# Altium project Battery_Charger_BQ24650.PrjPcb (part 2 of 3)
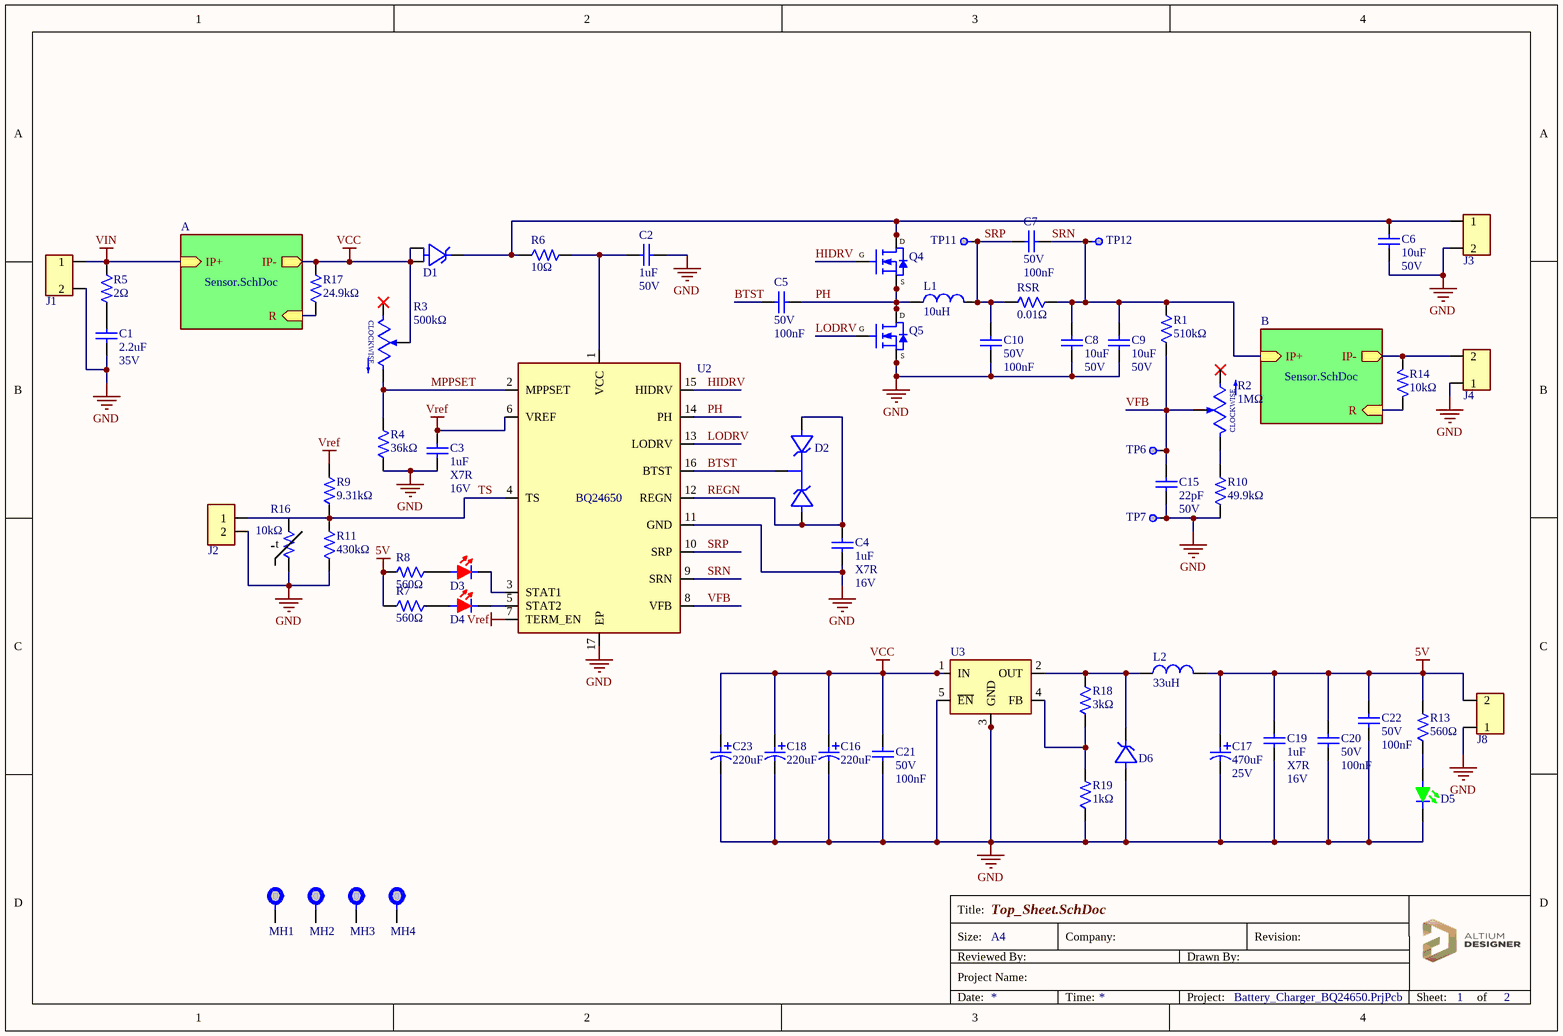
[diagram p2: Top_Sheet.SchDoc]

## Sheet Top_Sheet.SchDoc (continued)

### Library data of the parts
? = Title Block
C1 = Cap 2.2uF 35V X7R 1210(3225) 10% MLCC_GMK316B7225KLHT: Cap Ceramic 2.2uF 35V X7R 10% Pad SMD 1206 125C Automotive T/R; Manufacturer: Taiyo Yuden; Supplier: Digikey; Supplier Part Number: 587-3370-1-ND; Manufacturer Part Number: GMK316B7225KLHT; RoHS: Yes; Category: Ceramic Capacitors; Stock: 4692; Pricing: 1=0.26, 10=0.156, 100=0.1031, 1000=0.07388 (USD); ComponentLink1Description: DataSheet; ComponentLink1URL: https://mm.digikey.com/Volume0/opasdata/d220001/medias/docus/1904/GMK316B7225KLHT_SS.pdf; ComponentLink2Description: Digikey; ComponentLink2URL: https://www.digikey.com/en/products/detail/taiyo-yuden/GMK316B7225KLHT/4157593; ComponentLink3Description: Mouser; ComponentLink3URL: https://eu.mouser.com/ProductDetail/TAIYO-YUDEN/GMK316B7225KLHT?qs=CNQs48zzdnqgmIR1MOeXjQ%3D%3D
C2 = Cap 1uF 50V X7R 0805(2012) 10% MLCC_CL21B105KBFNNNE: Multilayer Ceramic Capacitor, 1 uF, 50 V, ± 10%, X7R, 0805 [2012 Metric]; Manufacturer: Samsung; Supplier 1: Digi-Key; Manufacturer Part Number: CL21B105KBFNNNE; RoHS: Yes; Category: Ceramic Capacitors; Stock 1: 1386161; Pricing 1: 1=0.11, 10=0.075, 50=0.045, 100=0.0354, 500=0.02616, 1000=0.02165 (USD); Mounting Technology: Surface Mount; Case/Package: 0805; Case Code (Metric): 2012; Case Code (Imperial): 0805; Material: Ceramic; Min Operating Temperature: -55°C; Max Operating Temperature: 125°C; Tolerance: 10%; Dielectric: X7R; Voltage Rating (DC): 50V; Packaging: Tape and Reel; Package Quantity: 1; Voltage: 50V; Series: CL; Construction: Flat; Length: 2mm; Width: 0.049inch; Height: 1.25mm; Depth: 1.25mm; Thickness: 0.053inch; RoHS Compliant: Yes; Supplier 2: Mouser; Stock 2: 143001; Pricing 2: 1=0.11, 10=0.045, 50=0.045, 100=0.027, 1000=0.026, 10000=0.015 (USD); Supplier Part Number 1: 1276-1029-1-ND; Supplier Part Number 2: 187-CL21B105KBFNNNE; ComponentLink1Description: DataSheet; ComponentLink1URL: https://mm.digikey.com/Volume0/opasdata/d220001/medias/docus/609/CL21B105KBFNNNE_Spec.pdf; ComponentLink2Description: Digikey; ComponentLink2URL: https://www.digikey.com/en/products/detail/samsung-electro-mechanics/CL21B105KBFNNNE/3886687; ComponentLink3Description: Mouser; ComponentLink3URL: https://eu.mouser.com/ProductDetail/Samsung-Electro-Mechanics/CL21B105KBFNNNE?qs=yOVawPpwOwmddQEBPU6Y9A%3D%3D; Radiation Hardening: No
C3 C4 C19 = Cap 1uF 16V X7R 0603(1608) 10% MLCC_CL10B105KO8NNNC: 1 µF ±10% 16V Ceramic Capacitor X7R 0603 (1608 Metric); Manufacturer: Samsung; Multilayer: Yes; Manufacturer Part Number: CL10B105KO8NNNC; RoHS: Yes; Category: Ceramic Capacitors; ComponentLink1Description: DataSheet; ComponentLink1URL: https://weblib.samsungsem.com/mlcc/mlcc-ec-data-sheet.do?partNumber=CL10B105KO8NNN; ComponentLink2Description: Digikey; ComponentLink2URL: https://www.digikey.com/en/products/detail/samsung-electro-mechanics/CL10B105KO8NNNC/3886677; ComponentLink3Description: Mouser; ComponentLink3URL: https://eu.mouser.com/ProductDetail/Samsung-Electro-Mechanics/CL10B105KO8NNNC?qs=349EhDEZ59o2mlUAs%2FkaKg%3D%3D; Supplier: Digikey; Supplier Part Number: 1276-1019-1-ND; Stock: 3938478; Pricing: 1=0.08, 10=0.018, 50=0.0148, 100=0.0112, 500=0.01, 1000=0.0088 (USD); Mounting Technology: Surface Mount; Pins: 2; Dielectric Material: Ceramic; Package Shape: Rectangular; Case/Package: 0603; Terminal Finish: Nickel; Min Operating Temperature: -55°C; Max Operating Temperature: 125°C; JESD-609 Code: e3; Termination: Wraparound; Capacitor Type: Ceramic; Tolerance  (fill in as +-): 10%; Packaging: Tape and Reel; Tolerance (fill in as +-): 10%; Reach SVHC Compliant: Yes; RoHS Compliant: Yes
C5 C7 C10 C20-C22 = Cap 100nF 50V X7R 0603(1608) 10% MLCC_CL10B104KB8NNWC: CAP CER 0.1UF 50V X7R 0603; Manufacturer: Samsung; Tolerance: 10%; Supplier 1: Digi-Key; Manufacturer Part Number: CL10B104KB8NNWC; RoHS: Yes; Category: Ceramic Capacitors; Stock 1: 12481520; Pricing 1: 1=0.10000, 10=0.01900, 50=0.01020, 100=0.00830, 500=0.00594, 1000=0.00467 (USD); Case/Package: 0603; Min Operating Temperature: -55°C; Max Operating Temperature: 125°C; Packaging: Cut Tape; Dielectric: X7R; Length: 0.063inch; RoHS Compliant: Yes; Supplier 2: Mouser; Stock 2: 1032910; Pricing 2: 1=0.1, 10=0.011, 50=0.011, 100=0.006, 1000=0.005, 10000=0.003 (USD); Supplier Part Number 1: 1276-1935-1-ND; Supplier Part Number 2: 187-CL10B104KB8NNWC; ComponentLink2Description: Digikey; ComponentLink2URL: https://www.digikey.com/en/products/detail/samsung-electro-mechanics/CL10B104KB8NNWC/3887593; ComponentLink3Description: DataSheet; ComponentLink3URL: https://media.digikey.com/pdf/Data%20Sheets/Samsung%20PDFs/CL10B104KB8NNWC_Spec.pdf; Mount: Surface Mount; Case Code (Metric): 1608; Case Code (Imperial): 0603; Contact Plating: Tin; Package Quantity: 1; Termination: Wraparound; Series: CL; Construction: Flat; Width: 0.031inch; Thickness: 0.035inch; ComponentLink4Description: Mouser; ComponentLink4URL: https://eu.mouser.com/ProductDetail/Samsung-Electro-Mechanics/CL10B104KB8NNWC?qs=EvNa9vf1TdYOAZGBJN%252BGRQ%3D%3D
C6 C8 C9 = Cap 10uF 50V 1210(3225) 10% MLCC X7R_CL32B106KBJNNNE: Multilayer Ceramic Capacitor, 10 uF, 50 V, ï¿½ 10%, X7R, 1210 [3225 Metric]; Manufacturer: Samsung; Supplier 1: Digikey; Manufacturer Part Number: CL32B106KBJNNNE; RoHS: Yes; Category: Ceramic Capacitors; Stock 1: 212314; Pricing 1: 1=0.59, 10=0.356, 50=0.2618, 100=0.2323, 500=0.1823 (USD); Voltage Rating (DC): 50V; Lead Free: 5697LeadFree; Supplier 2: Mouser; Stock 2: 284474; Pricing 2: 1=0.52, 10=0.281, 50=0.281, 100=0.181, 1000=0.151, 10000=0.124 (USD); Supplier Part Number 1: 1276-3387-1-ND; Supplier Part Number 2: 187-CL32B106KBJNNNE; ComponentLink1Description: DataSheet; ComponentLink1URL: https://mm.digikey.com/Volume0/opasdata/d220001/medias/docus/41/CL32B106KBJNNNE_Spec.pdf; ComponentLink2Description: Digikey; ComponentLink2URL: https://www.digikey.com/en/products/detail/samsung-electro-mechanics/CL32B106KBJNNNE/3889045?s=N4IgTCBcDaIIxgOwDYC0BmdAORq6oDkAREAXQF8g; ComponentLink3Description: Mouser; ComponentLink3URL: https://eu.mouser.com/ProductDetail/Samsung-Electro-Mechanics/CL32B106KBJNNNE?qs=349EhDEZ59rXK%2FOM74I5cg%3D%3D
C15 = Cap 22pF 50V X7R 0603(1608) 5% MLCC_06035C220JAT2A: 0603 22 pF 50 V ±5 % Tolerance X7R Surface Mount Multilayer Ceramic Capacitor; Manufacturer: Kyocera AVX; Supplier 1: Digi-Key; Manufacturer Part Number: 06035C220JAT2A; RoHS: Yes; Category: Ceramic Capacitors; Stock 1: 213034; Pricing 1: 1=0.1, 10=0.062, 50=0.0358, 100=0.0277, 500=0.02084, 1000=0.01637 (USD); Supplier 2: Mouser; Stock 2: 47793; Pricing 2: 1=0.1, 10=0.036, 50=0.036, 100=0.022, 1000=0.021, 10000=0.018 (USD); Supplier Part Number 1: 478-6204-1-ND; Supplier Part Number 2: 581-06035C220JAT2A; ComponentLink1Description: DataSheet; ComponentLink1URL: https://datasheets.kyocera-avx.com/X7RDielectric.pdf; ComponentLink2Description: Digikey; ComponentLink2URL: https://www.digikey.com/en/products/detail/kyocera-avx/06035C220JAT2A/1600097; ComponentLink3Description: Mouser; ComponentLink3URL: https://eu.mouser.com/ProductDetail/KYOCERA-AVX/06035C220JAT2A?qs=EbDiPP9peV8r1LlCcc83tg%3D%3D
C16 C18 C23 = Cap 220uF 50V 20% Alum.Electrolytic TH_UVZ1H221MPD: Capacitor Aluminum Electrolytic, 220uF 50 V, 1000h 10 (Dia) x 12.5mm, VZ Series; Manufacturer: Nichicon; Supplier: Digikey; Supplier Part Number: 493-1342-ND; Manufacturer Part Number: UVZ1H221MPD; RoHS: Yes; Category: Aluminum Electrolytic Capacitors; Stock: 9223; Pricing: 1=0.52, 10=0.328, 50=0.2496, 100=0.2246, 500=0.18054, 2000=0.15395, 4000=0.14352, 6000=0.13813 (USD); ComponentLink1Description: DataSheet; ComponentLink1URL: https://www.nichicon.co.jp/english/series_items/catalog_pdf/e-uvz.pdf; ComponentLink2Description: Digikey; ComponentLink2URL: https://www.digikey.com/en/products/detail/nichicon/UVZ1H221MPD/589083; ComponentLink3Description: Mouser; ComponentLink3URL: https://eu.mouser.com/ProductDetail/Nichicon/UVZ1H221MPD?qs=TcI%252BB%2FoBdJvNhhIN8Mps8g%3D%3D
C17 = Cap 470uF 25V 20% Alum.Electrolytic_860020474014: 470 µF 25 V Aluminum Electrolytic Capacitors Radial, Can 2000 Hrs @ 105°C; Manufacturer: Wurth Electronics; Dielectric Material: Aluminium; Supplier: Digikey; Supplier Part Number: 732-8831-1-ND; Manufacturer Part Number: 860020474014; RoHS: Yes; Category: Aluminum Electrolytic Capacitors; Stock: 471; Pricing: 1=0.32, 50=0.27, 100=0.2358, 250=0.20972 (USD); Pins: 2; Capacitor Type: Aluminium; Reach SVHC Compliant: Yes; RoHS Compliant: Yes; ComponentLink1Description: DataSheet; ComponentLink1URL: https://www.we-online.com/components/products/datasheet/860020474014.pdf; ComponentLink2Description: Digikey; ComponentLink2URL: https://www.digikey.com/en/products/detail/w%C3%BCrth-elektronik/860020474014/5727068; ComponentLink3Description: Mouser; ComponentLink3URL: https://eu.mouser.com/ProductDetail/Wurth-Elektronik/860020474014?qs=0KOYDY2FL2%252BfCDf5E%252Bq6Tw%3D%3D
D1 = Diode Schottky 45V 10A PowerDI5__SDT10A45P5-13: Tape & Reel (TR) Surface Mount Schottky SINGLE Diode Schottky 470mV @ 10A 10A 45V -55C~150C; Manufacturer: Diodes; Supplier: Digikey; Supplier Part Number: 31-SDT10A45P5-13CT-ND; Manufacturer Part Number: SDT10A45P5-13; RoHS: Yes; Category: LDO; Stock: 14618; Pricing: 1=0.48, 10=0.319, 100=0.247, 500=0.18708, 1000=0.15972, 2000=0.15144 (USD); Mounting Technology: Surface Mount; Series: -; Average Rectified Current: 10A; Max Reverse Voltage (DC): 45V; ComponentLink1Description: DataSheet; ComponentLink1URL: https://www.diodes.com/assets/Datasheets/SDT10A45P5.pdf; ComponentLink2Description: Digikey; ComponentLink2URL: https://www.digikey.com/en/products/detail/diodes-incorporated/SDT10A45P5-13/9769517; ComponentLink3Description: Mouser; ComponentLink3URL: https://eu.mouser.com/ProductDetail/Diodes-Incorporated/SDT10A45P5-13?qs=wUXugUrL1qzOQATtsgO6Zw%3D%3D
D2 = Diode Schottky 30V 0.2A SOT-23-3_BAT54C,215: BAT54 Series 30V 2 uA Surface Mount Schottky Barrier Diode - SOT-23; Manufacturer: Nexperia; Forward Current: 200mA; Forward Voltage: 800mV; Max Forward Surge Current (Ifsm): 600mA; Max Reverse Current: 2uA; Supplier 1: Digikey; Manufacturer Part Number: BAT54C,215; RoHS: Yes; Category: Schottky Diodes; Stock 1: 1185105; Pricing 1: 1=0.1, 10=0.07, 100=0.0469, 500=0.03554, 1000=0.03165 (USD); Case/Package: 926Case; Pins: 3NUMBER; Max Operating Temperature: 150°C; Packaging: 13Packaging; Value: 30V; Reverse Voltage: 30V; Height: 1.1mm; RoHS Compliant: 5897YesNo; Supplier 2: Mouser; Stock 2: 213968; Pricing 2: 1=0.1, 10=0.07, 50=0.07, 100=0.036, 1000=0.031, 10000=0.017 (USD); Supplier Part Number 1: 1727-2902-1-ND; Supplier Part Number 2: 771-BAT54C-T/R; ComponentLink1Description: DataSheet; ComponentLink1URL: https://assets.nexperia.com/documents/data-sheet/BAT54C.pdf; ComponentLink2Description: Digikey; ComponentLink2URL: https://www.digikey.com/en/products/detail/nexperia-usa-inc/BAT54C-215/763216?s=N4IgTCBcDaIIwHYwILRgJwAYwoGwoDkAREAXQF8g; ComponentLink3Description: Mouser; ComponentLink3URL: https://eu.mouser.com/ProductDetail/Nexperia/BAT54C215?qs=me8TqzrmIYV5SKKt13YKQA%3D%3D
D3 D4 = Diode LED RED 2.4V 30mA 0603(1608)_LTST-C190KRKT: LED LTST-C190KRKT; SMD 0603; czerwona 631-639nm; 99mcd /20mA; water clear; Manufacturer: Vishay Lite-On; Color: Red; Lens Color: Colorless; Luminous Intensity: 54mcd; Forward Current: 30mA; Viewing Angle: 130°; Forward Voltage: 2.4V; Lens Style: Flat,Diffused,Colorless,Rectangular,Clear; Power Rating: 75mW; Dominant Wavelength: 631nm; Test Current: 20mA; Number of Elements: 1; Reverse Voltage: 5V; Wavelength: 639nm; Tolerance: 20%; Voltage Rating: 50V; Lens Size: 0.8mm; Supplier 1: Digikey; Manufacturer Part Number: LTST-C190KRKT; RoHS: Yes; Category: LEDs; Stock 1: 201048; Pricing 1: 1=0.24, 10=0.133, 100=0.0617, 500=0.05696, 1000=0.04462, 2000=0.04367 (USD); Supplier 2: Mouser; Stock 2: 109362; Pricing 2: 1=0.24, 10=0.13, 50=0.13, 100=0.059, 1000=0.042, 10000=0.031 (USD); Supplier Part Number 1: 160-1436-1-ND; Supplier Part Number 2: 859-LTST-C190KRKT; ComponentLink1Description: DataSheet; ComponentLink1URL: https://optoelectronics.liteon.com/upload/download/DS-22-99-0151/LTST-C190KRKT.pdf; ComponentLink2Description: Digikey; ComponentLink2URL: https://www.digikey.com/en/products/detail/liteon/LTST-C190KRKT/386817; ComponentLink3Description: Mouser; ComponentLink3URL: https://eu.mouser.com/ProductDetail/Lite-On/LTST-C190KRKT?qs=kAD5fFa1n5VY3YYNWPC1Fg%3D%3D; Mounting Technology: Surface Mount; Case/Package: 0603; Pins: 2; Case Code (Metric): 1608; Case Code (Imperial): 0603; Min Operating Temperature: -55°C; Max Operating Temperature: 85°C; Packaging: Tape and Reel; Package Quantity: 3000; Illumination Color: Red; Lens Transparency: Clear; Power Dissipation: 75mW; Number of LEDs: 1; Series: -; Voltage Rating (DC): 50V; Length: 1.6mm; Width: 0.8mm; Height: 0.9mm; Depth: 0.8mm; Radiation Hardening: No; RoHS Compliant: Yes; Reach SVHC Compliant: 4186SVHC
D5 = Diode LED GREEN 2.1V 20mA 0603(1608)_LTST-C190GKT: Green 569nm LED Indication - Discrete 2.1V 0603 (1608 Metric); Manufacturer: Vishay Lite-On; Lens Color: Colorless; Luminous Intensity: 6mcd; Viewing Angle: 130°; Lens Style: Flat,Diffused,Colorless,Rectangular,Clear; Forward Current: 30mA; Test Current: 10mA; Lens Transparency: Clear; Number of Elements: 1; Power Dissipation: 100mW; Wavelength: 565nm; Reverse Voltage: 5V; Voltage: 2V; Lens Size: 0.8mm; Supplier 1: Digi-Key; Manufacturer Part Number: LTST-C190GKT; RoHS: Yes; Category: LEDs; Stock 1: 690563; Pricing 1: 1=0.23, 10=0.126, 100=0.0587, 500=0.05414, 1000=0.04241, 2000=0.04151 (USD); Mounting Technology: Surface Mount; Case/Package: 0603; Pins: 2; Color: Green; Case Code (Metric): 1608; Case Code (Imperial): 0603; Min Operating Temperature: -55°C; Max Operating Temperature: 85°C; Forward Voltage: 2.1V; Package Quantity: 1; Packaging: Tape and Reel; Illumination Color: Green; Dominant Wavelength: 569nm; Number of LEDs: 1; Power Rating: 100mW; Series: -; Length: 1.6mm; Width: 0.8mm; Height: 0.9mm; Depth: 0.8mm; Radiation Hardening: No; Lead Free: Lead Free; RoHS Compliant: Yes; Supplier 2: Mouser; Stock 2: 352473; Pricing 2: 1=0.24, 10=0.132, 50=0.132, 100=0.062, 1000=0.044, 10000=0.032 (USD); Supplier Part Number 1: 160-1183-1-ND; Supplier Part Number 2: 859-LTST-C190GKT; ComponentLink1Description: DataSheet; ComponentLink1URL: https://mm.digikey.com/Volume0/opasdata/d220001/medias/docus/858/LTST-C190GKT.pdf; ComponentLink2Description: Digikey; ComponentLink2URL: https://www.digikey.com/en/products/detail/liteon/LTST-C190GKT/269230?s=N4IgTCBcDaIDIBUDKCC0BhAjATgAwHEBpBEAXQF8g; ComponentLink3Description: Mouser; ComponentLink3URL: https://eu.mouser.com/ProductDetail/Lite-On/LTST-C190GKT?qs=drxkyCeiWgbQzclgbojDOg%3D%3D
D6 = Diode Schottky 30V 5A SMD SOD-128_PMEG3050EP,115: Rectifier Diode Schottky 30V 5A Automotive 2-Pin SOD-128 T/R / DIODE SCHOTTKY 30V 5A SOD128; Manufacturer: Nexperia; Element Configuration: 5460ElementConfiguration; Forward Voltage: 360mV; Max Forward Surge Current (Ifsm): 70A; Max Reverse Current: 2.6mA; Max Power Dissipation: 625mW; Supplier 1: Digikey; Manufacturer Part Number: PMEG3050EP,115; RoHS: Yes; Category: Schottky Diodes; Pricing 1: 1=0.61, 10=0.412, 100=0.2806, 500=0.22056, 1000=0.20071 (USD); Mounting Technology: 8Mount; Case/Package: 2175Case; Pins: 2NUMBER; Min Operating Temperature: -55°C; Max Operating Temperature: 150°C; Value: 30V; Forward Current: 5A; Max Repetitive Reverse Voltage (Vrrm): 30V; Peak Non-Repetitive Surge Current: 70A; Average Rectified Current: 5A; Max Reverse Voltage (DC): 30V; Reverse Voltage: 30V; Height: 1.1mm; Radiation Hardening: 5898YesNo; RoHS Compliant: Yes; Reach SVHC Compliant: 4186SVHC; Lead Free: 5697LeadFree; Supplier 2: Mouser; Stock 2: 34299; Pricing 2: 1=0.59, 10=0.412, 50=0.412, 100=0.281, 1000=0.201, 10000=0.153 (USD); Supplier Part Number 1: 1727-5317-1-ND; Supplier Part Number 2: 771-PMEG3050EP115; ComponentLink1Description: DataSheet; ComponentLink1URL: https://assets.nexperia.com/documents/data-sheet/PMEG3050EP.pdf; ComponentLink2Description: Digikey; ComponentLink2URL: https://www.digikey.com/en/products/detail/nexperia-usa-inc/PMEG3050EP-115/2228695?s=N4IgTCBcDaIIwHYwILQFYDMiVhQOQBEQBdAXyA; ComponentLink3Description: Mouser; ComponentLink3URL: https://eu.mouser.com/ProductDetail/Nexperia/PMEG3050EP115?qs=GcY6OjH1zdmnjQ%2FhUT5aOA%3D%3D
J1 J3 J4 J8 = HDR/Conn 2 Pos 5mm TH TB_282836-2: Connector, Terminal Block; Wire Receptacle; 2 Pos.; 16-30 AWG; 0.197 in. CL; Sid; Manufacturer: TE Connectivity; Plating: Brass; Number of Positions: 2; Number of Levels: 1; Current: 13.5A; Voltage: 300V; Interlock: Yes (With); Screw Flange: No (Without); Connector System: 5937ConnectorSystem; Voltage Rating (DC): 250V; Pitch: 5mm; Wire Gauge (Max): 30AWG; Thread Size: M3; Tail Length: 3.5mm; Approvals: UL; Supplier 1: Digikey; Manufacturer Part Number: 282836-2; RoHS: Yes; Category: Terminal Blocks; Stock 1: 32521; Pricing 1: 1=0.69, 10=0.548, 25=0.4668, 50=0.4434, 100=0.4115, 300=0.39413, 600=0.38072, 1200=0.35753, 5100=0.30574 (USD); Mounting Technology: Through Hole; Color: Green; Contact Material: Brass; Housing Color: Green; Contact Plating: Tin; Housing Material: Polyamide; Min Operating Temperature: -40°C; Max Operating Temperature: 105°C; Number of Rows: 1; Termination: Solder; Series: Buchanan; Packaging: Tray; Package Quantity: 300; Number of Positions Per Level: 2; Number of Contacts: 2; Orientation: Straight; Current Rating: 13.5A; Number of Circuits: 2; Screwless Terminal Block: No (Without); Side Stackable: Yes (With); Operating Supply Voltage: 300V; Voltage Rating: 300V; Max Voltage Rating (AC): 300V; Number of Poles: 2; Max Supply Voltage (AC): 300V; Connector Type: Receptacle; Closed End: No (Without); Max Current Rating: 13.5A; Length: 10.6mm; Width: 10mm; Wire Gauge (Min): 30AWG; Wire/Cable Gauge: 30AWG; Depth: 8.2mm; Radiation Hardening: No; Flammability Rating: UL94 V-0; RoHS Compliant: Yes; ELV: Compliant; Lead Free: Lead Free; Reach SVHC Compliant: Unknown; Supplier 2: Mouser; Stock 2: 17355; Pricing 2: 1=0.57, 10=0.437, 50=0.437, 100=0.359, 1000=0.34, 10000=0.303 (USD); Supplier Part Number 1: A98076-ND; Supplier Part Number 2: 571-2828362; ComponentLink1Description: DataSheet; ComponentLink1URL: https://www.te.com/commerce/DocumentDelivery/DDEController?Action=srchrtrv&DocNm=1308389_EUROSTYLE_TERMINAL_BLOCKS&DocType=CS&DocLang=English; ComponentLink2Description: Digikey; ComponentLink2URL: https://www.digikey.com/en/products/detail/te-connectivity-amp-connectors/282836-2/1826939?s=N4IgTCBcDaIIIE4AcAGA7ANgLQDkAiIAugL5A; ComponentLink3Description: Mouser; ComponentLink3URL: https://eu.mouser.com/ProductDetail/TE-Connectivity/282836-2?qs=A%252Bip%252BNCYi6Ohx9vaQ1l4dg%3D%3D
J2 = HDR/Conn 2 POS 2.5mm TH Male_B2B-XH-A: Board Connector, 2 Contact(s), 1 Row(s), Male, Straight, Solder Terminal,; Manufacturer: JST; Supplier 1: Digi-Key; Manufacturer Part Number: B2B-XH-A; RoHS: Yes; Category: FFC / FPC; Stock 1: 1122126; Pricing 1: 1=0.15, 10=0.122, 100=0.0898, 500=0.07432, 1000=0.06502, 5000=0.05573, 10000=0.05419 (USD); Supplier Part Number 1: 455-B2B-XH-A-ND; ComponentLink1Description: DataSheet; ComponentLink1URL: https://www.jst-mfg.com/product/pdf/eng/eXH.pdf; ComponentLink2Description: Digikey; ComponentLink2URL: https://www.digikey.com/en/products/detail/jst-sales-america-inc/B2B-XH-A/1651045
L1 = Ind 10uH 9A SMD_125CDMCCDS-100MC: Ind Chip Power Metal Compound 10uH 20% 2-Pin SMD T/R; Manufacturer: Sumida; Saturation Current: 14A; Shielding: Shielded; DC Resistance (DCR): 22mR; Test Frequency: 100kHz; Supplier 1: Digikey; Manufacturer Part Number: 125CDMCCDS-100MC; RoHS: Yes; Category: Fixed Inductors; Stock 1: 68; Pricing 1: 1=1.52, 10=1.289, 25=1.1884, 50=1.062, 100=0.8849, 250=0.85964 (USD); Mounting Technology: Surface Mount; Case/Package: Nonstandard; Core Material: Metal; Min Operating Temperature: -55°C; Max Operating Temperature: 125°C; Series: 125CDMCC/DS; Packaging: Cut Tape; Tolerance: 20%; RoHS Compliant: Yes; Supplier 2: Mouser; Stock 2: 570; Pricing 2: 1=1.52, 10=1.07, 50=1.07, 100=0.885, 1000=0.645, 10000=0.645 (USD); Supplier Part Number 1: 308-2561-1-ND; Supplier Part Number 2: 851-125CDMCCDS100MC; ComponentLink1Description: DataSheet; ComponentLink1URL: https://products.sumida.com/products/pdf/125CDMCCDS%20(en).pdf; ComponentLink2Description: Digikey; ComponentLink2URL: https://www.digikey.com/en/products/detail/sumida-america-inc/125CDMCCDS-100MC/9490412?s=N4IgTCBcDaIMwAYAcBaMBWAbARhbgcgCIgC6AvkA; ComponentLink3Description: Mouser; ComponentLink3URL: https://eu.mouser.com/ProductDetail/Sumida/125CDMCCDS-100MC?qs=%252BEew9%252B0nqrBnTd0Yj4LJzA%3D%3D
L2 = Ind 33uH 3A SMD_B82477G4333M000: Inductor Power Shielded Wirewound 33uH 20% 100KHz Ferrite 3A 53mOhm DCR Automotive Blister; Manufacturer: TDK EPCOS; Supplier 1: Digikey; Manufacturer Part Number: B82477G4333M000; RoHS: Yes; Category: Fixed Inductors; Stock 1: 1511; Pricing 1: 1=1.26, 10=0.982, 25=0.8884, 50=0.823, 100=0.7624 (USD); Supplier 2: Mouser; Stock 2: 2432; Pricing 2: 1=1.32, 10=0.956, 50=0.956, 100=0.653, 1000=0.576, 10000=0.507 (USD); Supplier Part Number 1: 495-4408-1-ND; Supplier Part Number 2: 871-B82477G4333M; ComponentLink1Description: DataSheet; ComponentLink1URL: https://www.tdk-electronics.tdk.com/inf/30/db/ind_2008/b82477g4.pdf; ComponentLink2Description: Digikey; ComponentLink2URL: https://www.digikey.com/en/products/detail/epcos-tdk-electronics/B82477G4333M000/2651640?s=N4IgTCBcDaICwE4CsBaOcAMAOFBGFAcgCIgC6AvkA; ComponentLink3Description: Mouser; ComponentLink3URL: https://eu.mouser.com/ProductDetail/EPCOS-TDK/B82477G4333M?qs=%2FkiEPUfD%2FqndE5CDVseAgw%3D%3D
MH1-MH4 = Mounting Hole M3 D3.5mm
Q4 Q5 = Trans N-Channel 30V 12A PowerPak 1212-8_SIS412DN-T1-GE3: SiS412DN Series N-Channel 30 V 24 mOhms SMT Power Mosfet - PowerPAK-1212-8; Manufacturer: Vishay Siliconix; Supplier 1: Digikey; Manufacturer Part Number: SIS412DN-T1-GE3; RoHS: Yes; Category: MOSFETs; Stock 1: 40457; Pricing 1: 1=0.73, 10=0.491, 100=0.3361, 500=0.26568, 1000=0.24245 (USD); Supplier 2: Mouser; Stock 2: 21775; Pricing 2: 1=0.64, 10=0.459, 50=0.459, 100=0.332, 1000=0.239, 10000=0.215 (USD); Supplier Part Number 1: SIS412DN-T1-GE3CT-ND; Supplier Part Number 2: 781-SIS412DN-T1-GE3; ComponentLink1Description: DataSheet; ComponentLink1URL: https://www.vishay.com/docs/69006/sis412dn_new.pdf; ComponentLink2Description: Digikey; ComponentLink2URL: https://www.digikey.com/en/products/detail/vishay-siliconix/SIS412DN-T1-GE3/2441823?s=N4IgTCBcDaIMoEk4BYCMYAiA5AtAFVRwHEBRAZgGE8csMQBdAXyA; ComponentLink3Description: Mouser; ComponentLink3URL: https://eu.mouser.com/ProductDetail/Vishay-Semiconductors/SIS412DN-T1-GE3?qs=cPOO8qjhL6NqDrBget0Fyg%3D%3D
R1 = Res 510kΩ 0603(1608) 1% 0.1W_RMCF0603FT510K: Res Thick Film 0603 510kΩ 1% 1/10W ±100ppm/°C Molded SMD SMD Paper T/R; Manufacturer: Stackpole Electronics; Max Power Dissipation: 100mW; Voltage Rating: 75V; Supplier: Digikey; Supplier Part Number: RMCF0603FT510KCT-ND; Manufacturer Part Number: RMCF0603FT510K; RoHS: Yes; Category: Chip SMD Resistors; Stock: 158871; Pricing: 1=0.1, 10=0.015, 50=0.0092, 100=0.0075, 500=0.0049, 1000=0.00415 (USD); Mounting Technology: Surface Mount; Case/Package: 0603; Case Code (Metric): 1608; Case Code (Imperial): 0603; Contact Plating: Tin,Matte; Min Operating Temperature: -55°C; Max Operating Temperature: 155°C; Package Quantity: 5000; Packaging: Tape and Reel; Tolerance: 1%; Number of Terminations: 2; Temperature Coefficient: 100ppm/°C; Features: Automotive AEC-Q200; Series: RMCF; Length: 0.061inch; Width: 0.031inch; Height: 0.022inch; Radiation Hardening: No; RoHS Compliant: Yes; Lead Free: 5697LeadFree; ComponentLink1Description: DataSheet; ComponentLink1URL: https://www.seielect.com/catalog/sei-rmcf_rmcp.pdf; ComponentLink2Description: Digikey; ComponentLink2URL: https://www.digikey.com/en/products/detail/stackpole-electronics-inc/RMCF0603FT510K/1760917; ComponentLink3Description: Mouser; ComponentLink3URL: https://eu.mouser.com/ProductDetail/SEI-Stackpole/RMCF0603FT510K?qs=IPgv5n7u5QbYeemNzzOorg%3D%3D
R2 = Res POT 1MΩ 10% 0.5W_3361P-1-105GLF: Resistor Trimmer, Cermet, 1MΩ, ± 10%, 500 mW, 1 Turn, Single Turn, Surface Mount; Manufacturer: Bourns; Supplier: Digikey; Supplier Part Number: 3361P-1-105GLFCT-ND; Manufacturer Part Number: 3361P-1-105GLF; RoHS: Yes; Category: Variable Resistors and Potentiometers; Stock: 1435; Pricing: 1=1.37, 10=1.1, 25=1.008, 50=0.9434, 100=0.8826, 250=0.80784 (USD); ComponentLink1Description: DataSheet; ComponentLink1URL: https://www.bourns.com/docs/Product-Datasheets/3361.pdf; ComponentLink2Description: Digikey; ComponentLink2URL: https://www.digikey.com/en/products/detail/bourns-inc/3361P-1-105GLF/1817612; ComponentLink3Description: Mouser; ComponentLink3URL: https://eu.mouser.com/ProductDetail/Bourns/3361P-1-105GLF?qs=fHAReS3gvjLSMYSnFcSX8Q%3D%3D
R3 = Res POT 500kΩ 10% 0.5W_3361P-1-504GLF: SMD Single-Turn Trimmer Potentiometers 1/4 SQ 500KOHMS 10% 0.5WATTS; Manufacturer: Bourns; Manufacturer Part Number: 3361P-1-504GLF; RoHS: Yes; ComponentLink1Description: DataSheet; ComponentLink1URL: https://www.bourns.com/docs/Product-Datasheets/3361.pdf; ComponentLink2Description: Digikey; ComponentLink2URL: https://www.digikey.com/en/products/detail/bourns-inc/3361P-1-504GLF/1817611; ComponentLink3Description: Mouser; ComponentLink3URL: https://eu.mouser.com/ProductDetail/Bourns/3361P-1-504GLF?qs=fqIB%2FsSTfTaKxcvNNIdl2Q%3D%3D; Supplier: Digikey; Supplier Part Number: 3361P-1-504GLFCT-ND; Category: Variable Resistors and Potentiometers; Stock: 1099; Pricing: 1=1.37, 10=1.1, 25=1.008, 50=0.9434, 100=0.8826, 250=0.80784 (USD)
R4 = Res 36kΩ 0603(1608) 1% 0.1W_RK73H1JTTD3602F: Res Thick Film 0603 36kΩ 1% 0.1W(1/10W) ±100ppm/C Pad SMD Automotive T/R; Manufacturer: KOA Speer; Power Rating: 100mW; Voltage Rating: 50V; Temperature Coefficient: 100ppm/°C; Supplier 1: Digi-Key; Manufacturer Part Number: RK73H1JTTD3602F; RoHS: Yes; Category: Chip SMD Resistors; Stock 1: 196036; Pricing 1: 1=0.1, 10=0.021, 50=0.013, 100=0.0108, 500=0.00734, 1000=0.00631 (USD); Supplier 2: Mouser; Stock 2: 199931; Pricing 2: 1=0.1, 10=0.014, 50=0.014, 100=0.007, 1000=0.005, 10000=0.003 (USD); Supplier Part Number 1: 2019-RK73H1JTTD3602FCT-ND; Supplier Part Number 2: 660-RK73H1JTTD3602F; ComponentLink1Description: DataSheet; ComponentLink1URL: https://www.koaspeer.com/pdfs/RK73H.pdf; ComponentLink2Description: Digikey; ComponentLink2URL: https://www.digikey.com/en/products/detail/koa-speer-electronics-inc/RK73H1JTTD3602F/9845186; ComponentLink3Description: Mouser; ComponentLink3URL: https://eu.mouser.com/ProductDetail/KOA-Speer/RK73H1JTTD3602F?qs=SsozRxUJO6Tb%252B7Xx8%2F1zLA%3D%3D; Case/Package: 0603; Pins: 2; Case Code (Imperial): 0603; Case Code (Metric): 1608; Min Operating Temperature: -55°C; Max Operating Temperature: 155°C; Tolerance: 1%; Packaging: Tape and Reel; Package Quantity: 5000; Resistor Type: Thick Film; Termination: SMD/SMT; Series: RK73H; Construction: Rectangular; Resistance Tolerance: 1%; Length: 1.6mm; Width: 0.8mm; Height: 0.45mm; Depth: 0.8mm; Military Standard: Not; Lead Free: Lead Free; RoHS Compliant: Yes; Reach SVHC Compliant: Unknown
R5 = Res 2Ω 2512(6432) 5% 1W_RMCF2512JT2R00: Res Thick Film 2512 2Ω 5% 1W ±400ppm/°C Molded SMD SMD Plastic T/R; Manufacturer: Stackpole Electronics; Supplier 1: Digikey; Manufacturer Part Number: RMCF2512JT2R00; RoHS: Yes; Category: Chip SMD Resistors; Stock 1: 306573; Pricing 1: 1=0.16, 10=0.083, 50=0.057, 100=0.0491, 500=0.03606, 1000=0.03195 (USD); Supplier 2: Mouser; Stock 2: 126711; Pricing 2: 1=0.16, 10=0.057, 50=0.057, 100=0.036, 1000=0.032, 10000=0.025 (USD); Supplier Part Number 1: RMCF2512JT2R00CT-ND; Supplier Part Number 2: 708-RMCF2512JT2R00; ComponentLink1Description: DataSheet; ComponentLink1URL: https://www.seielect.com/catalog/sei-rmcf_rmcp.pdf; ComponentLink2Description: Digikey; ComponentLink2URL: https://www.digikey.com/en/products/detail/stackpole-electronics-inc/RMCF2512JT2R00/1757010?s=N4IgTCBcDaIEoFkDCAxMBWAjGAUgFTDgAYik8BaAOQBEQBdAXyA; ComponentLink3Description: Mouser; ComponentLink3URL: https://eu.mouser.com/ProductDetail/SEI-Stackpole/RMCF2512JT2R00?qs=FESYatJ8odIHoxqdUGtqxw%3D%3D
R6 = Res 10Ω 1206(3216) 1% 1W_CSRT1206FT10R0: 10Ω ±1% 1W Chip Resistor 1206 (3216 Metric) Automotive AEC-Q200, Current Sense Thin Film; Manufacturer: Stackpole Electronics; Manufacturer Part Number: CSRT1206FT10R0; RoHS: Yes; Category: Chip SMD Resistors; ComponentLink1Description: DataSheet; ComponentLink1URL: https://www.seielect.com/catalog/sei-csrt.pdf; ComponentLink2Description: Digikey; ComponentLink2URL: https://www.digikey.com/en/products/detail/stackpole-electronics-inc/CSRT1206FT10R0/16206710; ComponentLink3Description: Mouser; ComponentLink3URL: CSRT1206FT10R0; Supplier: Digikey; Supplier Part Number: 738-CSRT1206FT10R0CT-ND; Stock: 4729; Pricing: 1=0.3, 10=0.168, 25=0.1348, 50=0.1146, 100=0.098, 250=0.08028, 500=0.06944, 1000=0.0604 (USD)
R7 R8 R13 = Res 560Ω 0603(1608) 1% 1/8W_RK73H1JTTD5600F: Res Thick Film 0603 560Ω 1% 0.125W(1/8W) ±100ppm/C Pad SMD Automotive T/R; Manufacturer: KOA Speer; Temperature Coefficient: 100ppm/°C; Power Rating: 100mW; Voltage Rating: 50V; Max Power Dissipation: 125mW; Supplier 1: Digikey; Manufacturer Part Number: RK73H1JTTD5600F; RoHS: Yes; Category: Chip SMD Resistors; Stock 1: 102901; Pricing 1: 1=0.1, 10=0.021, 50=0.013, 100=0.0108, 500=0.00734, 1000=0.00631 (USD); Case/Package: 0603; Case Code (Metric): 1608; Case Code (Imperial): 0603; Min Operating Temperature: -55°C; Max Operating Temperature: 155°C; Tolerance: 1%; Packaging: Tape and Reel; Number of Terminations: 2; Termination: SMD/SMT; Voltage Rating (DC): 50V; Features: Moisture Resistant,Automotive AEC-Q200; Series: RK73H; Construction: Rectangular; Length: 1.6mm; Depth: 0.8mm; Military Standard: Not; Lead Free: Lead Free; RoHS Compliant: Yes; Supplier 2: Mouser; Stock 2: 113408; Pricing 2: 1=0.1, 10=0.014, 50=0.014, 100=0.007, 1000=0.005, 10000=0.003 (USD); Supplier Part Number 1: 2019-RK73H1JTTD5600FCT-ND; Supplier Part Number 2: 660-RK73H1JTTD5600F; ComponentLink1Description: DataSheet; ComponentLink1URL: https://www.koaspeer.com/pdfs/RK73H.pdf; ComponentLink2Description: Digikey; ComponentLink2URL: https://www.digikey.com/en/products/detail/koa-speer-electronics-inc/RK73H1JTTD5600F/9845004; ComponentLink3Description: Mouser; ComponentLink3URL: https://eu.mouser.com/ProductDetail/KOA-Speer/RK73H1JTTD5600F?qs=xvPx1Sss7ZGkGQIBdLACSQ%3D%3D; Package Quantity: 5000; Resistor Type: Thick Film; Resistance Tolerance: 1%; Width: 0.8mm; Height: 0.45mm; Ratings: AEC-Q200; Reach SVHC Compliant: Unknown
R9 = Res 9.31kΩ 0603(1608) 1% 0.1W_RMCF0603FT9K31: Res Thick Film 0603 9.31kΩ 1% 0.1W ±100ppm/°C Molded SMD Paper T/R; Manufacturer: Stackpole Electronics; Voltage Rating: 75V; Supplier: Digikey; Supplier Part Number: RMCF0603FT9K31CT-ND; Manufacturer Part Number: RMCF0603FT9K31; RoHS: Yes; Category: Chip SMD Resistors; Stock: 28454; Pricing: 1=0.1, 10=0.015, 50=0.0092, 100=0.0075, 500=0.0049, 1000=0.00415 (USD); Lead Free: 5697LeadFree; ComponentLink1Description: DataSheet; ComponentLink1URL: https://www.seielect.com/catalog/sei-rmcf_rmcp.pdf; ComponentLink2Description: Digikey; ComponentLink2URL: https://www.digikey.com/en/products/detail/stackpole-electronics-inc/RMCF0603FT9K31/1760972; ComponentLink3Description: Mouser; ComponentLink3URL: https://eu.mouser.com/ProductDetail/SEI-Stackpole/RMCF0603FT9K31?qs=FESYatJ8odJF%2F6oKMkuOfw%3D%3D
R10 = Res 49.9kΩ 0603(1608) 1% 0.1W_RMCF0603FT49K9: Res Thick Film 0603 49.9kΩ 1% 0.1W ±100ppm/°C Molded SMD Paper T/R; Manufacturer: Stackpole Electronics; Voltage Rating: 75V; Supplier: Digikey; Supplier Part Number: RMCF0603FT49K9CT-ND; Manufacturer Part Number: RMCF0603FT49K9; RoHS: Yes; Category: Chip SMD Resistors; Stock: 463064; Pricing: 1=0.1, 10=0.015, 50=0.0092, 100=0.0075, 500=0.0049, 1000=0.00415 (USD); Lead Free: 5697LeadFree; ComponentLink1Description: DataSheet; ComponentLink1URL: https://www.seielect.com/catalog/sei-rmcf_rmcp.pdf; ComponentLink2Description: Digikey; ComponentLink2URL: https://www.digikey.com/en/products/detail/stackpole-electronics-inc/RMCF0603FT49K9/1760907; ComponentLink3Description: Mouser; ComponentLink3URL: https://eu.mouser.com/ProductDetail/SEI-Stackpole/RMCF0603FT49K9?qs=FESYatJ8odKHqtEvmpwEUg%3D%3D
R11 = Res 430kΩ 0603(1608) 1% 0.1W_RMCF0603FT430K: Res Thick Film 0603 430kΩ 1% 1/10W ±100ppm/°C Molded SMD SMD Paper T/R; Manufacturer: Stackpole Electronics; Max Power Dissipation: 100mW; Voltage Rating: 75V; Supplier: Digikey; Supplier Part Number: RMCF0603FT430KCT-ND; Manufacturer Part Number: RMCF0603FT430K; RoHS: Yes; Category: Chip SMD Resistors; Stock: 16624; Pricing: 1=0.1, 10=0.015, 50=0.0092, 100=0.0075, 500=0.0049, 1000=0.00415 (USD); Mounting Technology: Surface Mount; Case/Package: 0603; Case Code (Metric): 1608; Case Code (Imperial): 0603; Contact Plating: Tin,Matte; Min Operating Temperature: -55°C; Max Operating Temperature: 155°C; Packaging: Tape and Reel; Tolerance: 1%; Package Quantity: 5000; Number of Terminations: 2; Temperature Coefficient: 100ppm/°C; Features: Automotive AEC-Q200; Series: RMCF; Length: 0.061inch; Width: 0.031inch; Height: 0.022inch; Radiation Hardening: No; RoHS Compliant: Yes; ComponentLink1Description: DataSheet; ComponentLink1URL: https://www.seielect.com/catalog/sei-rmcf_rmcp.pdf; ComponentLink2Description: Digikey; ComponentLink2URL: https://www.digikey.com/en/products/detail/stackpole-electronics-inc/RMCF0603FT430K/1714043; ComponentLink3Description: Mouser; ComponentLink3URL: https://eu.mouser.com/ProductDetail/SEI-Stackpole/RMCF0603FT430K?qs=IPgv5n7u5QYVDse0RIO5pw%3D%3D
R14 = Res 10kΩ 0603(1608) 1% 0.1W_RK73H1JTTD1002F: Resistor Thick Film 0603 10K Ohm 1% 1/10W ±100ppm/°C SMD Punched Paper Tape and Reel; Manufacturer: KOA Speer; Power Rating: 100mW; Voltage Rating: 50V; Supplier 1: Digi-Key; Manufacturer Part Number: RK73H1JTTD1002F; RoHS: Yes; Category: Chip SMD Resistors; Stock 1: 3368554; Pricing 1: 1=0.1, 10=0.026, 100=0.0105, 1000=0.00472, 2500=0.0041 (USD); Case/Package: 0603; Case Code (Imperial): 0603; Case Code (Metric): 1608; Min Operating Temperature: -55°C; Max Operating Temperature: 155°C; Resistor Type: Thick Film; Tolerance: 1%; Temperature Coefficient: 100ppm/°C; Packaging: Tape and Reel; Termination: SMD/SMT; Features: Moisture Resistant,Automotive AEC-Q200; Series: RK73H; Max Power Dissipation: 100mW; Number of Terminations: 2; Resistance Tolerance: 1%; Construction: Rectangular; Length: 1.6mm; Width: 0.8mm; Height: 0.45mm; Depth: 0.8mm; RoHS Compliant: Yes; Military Standard: Not; Reach SVHC Compliant: Unknown; Lead Free: Lead Free; Supplier 2: Mouser; Stock 2: 680823; Pricing 2: 1=0.1, 10=0.013, 50=0.013, 100=0.008, 1000=0.005, 10000=0.004 (USD); Supplier Part Number 1: 2019-RK73H1JTTD1002FCT-ND; Supplier Part Number 2: 660-RK73H1JTTD1002F; ComponentLink2Description: DataSheet; ComponentLink2URL: https://www.koaspeer.com/pdfs/RK73H.pdf; Pins: 2; Package Quantity: 5000; Voltage Rating (DC): 50V; Ratings: AEC-Q200; ComponentLink4Description: Digikey; ComponentLink4URL: https://www.digikey.com/en/products/detail/koa-speer-electronics-inc/RK73H1JTTD1002F/9844954; ComponentLink5Description: Mouser; ComponentLink5URL: https://eu.mouser.com/ProductDetail/KOA-Speer/RK73H1JTTD1002F?qs=%252BHd4ebZ%252Bq6V15kIYdKv25A%3D%3D
R16 = Res 10k 1% NTC Bead 3435k TH_NTCLE413E2103F520L: NTC Thermistors, NTC epoxy PVC AWG30 10K 1% 3435K L52 | Vishay Dale NTCLE413E2103F520L; Manufacturer: Vishay BCcomponents; Max Power Dissipation: 250mW; Power Rating: 100mW; Lead Diameter: 1mm; Supplier 1: Digikey; Manufacturer Part Number: NTCLE413E2103F520L; RoHS: Yes; Category: Linear ICs; Stock 1: 76899; Pricing 1: 1=1.4, 5=1.176, 10=1.093, 25=0.9912, 50=0.9212, 100=0.8559, 500=0.72194, 1000=0.67095, 5000=0.6435 (USD); Mounting Technology: Through Hole; Pins: 2; Min Operating Temperature: -40°C; Max Operating Temperature: 105°C; Packaging: Bulk; Tolerance: 1%; Termination: Through Hole; Resistance Tolerance: 1%; Series: -; RoHS Compliant: Yes; Reach SVHC Compliant: Unknown; Supplier 2: Mouser; Stock 2: 13171; Pricing 2: 1=1.18, 10=0.908, 50=0.908, 100=0.84, 1000=0.736, 10000=0.736 (USD); Supplier Part Number 1: BC2646-ND; Supplier Part Number 2: NTCLE413E2103F520L; ComponentLink1Description: DataSheet; ComponentLink1URL: https://www.vishay.com/docs/29078/ntcle413.pdf; ComponentLink2Description: Digikey; ComponentLink2URL: https://www.digikey.com/en/products/detail/vishay-beyschlag-draloric-bc-components/NTCLE413E2103F520L/2348990?s=N4IgTCBcDaIEIGEwDYAsyC0A5AIiAugL5A; ComponentLink3Description: Mouser; ComponentLink3URL: https://eu.mouser.com/ProductDetail/Vishay-BC-Components/NTCLE413E2103F520L?qs=RECgZY%252BK1xIfQ9JFga9iNA%3D%3D
R17 = Res 24.9kΩ 0805(2012) 1% 1/4W_RK73H2ATTD2492F: Res Thick Film 0805 24.9kΩ 1% 0.25W(1/4W) ±100ppm/C Pad SMD Automotive T/R; Manufacturer: KOA Speer; Voltage Rating: 150V; Power Rating: 125mW; Temperature Coefficient: 100ppm/°C; Supplier 1: Digikey; Manufacturer Part Number: RK73H2ATTD2492F; RoHS: Yes; Category: Chip SMD Resistors; Stock 1: 15296; Pricing 1: 1=0.1, 10=0.031, 50=0.0192, 100=0.016, 500=0.0108, 1000=0.00929 (USD); Case/Package: 0805; Case Code (Imperial): 0805; Case Code (Metric): 2012; Min Operating Temperature: -55°C; Max Operating Temperature: 155°C; Tolerance: 1%; Packaging: Tape and Reel; Package Quantity: 5000; Termination: SMD/SMT; Voltage Rating (DC): 150V; Series: RK73H; Construction: Rectangular; Length: 2mm; Width: 1.25mm; Height: 0.5mm; Depth: 1.25mm; Military Standard: Not; Lead Free: Lead Free; RoHS Compliant: Yes; Supplier 2: Mouser; Stock 2: 9628; Pricing 2: 1=0.1, 10=0.018, 50=0.018, 100=0.01, 1000=0.008, 10000=0.005 (USD); Supplier Part Number 1: 2019-RK73H2ATTD2492FCT-ND; Supplier Part Number 2: 660-RK73H2ATTD2492F; ComponentLink1Description: DataSheet; ComponentLink1URL: https://www.koaspeer.com/pdfs/RK73H.pdf; ComponentLink2Description: Digikey; ComponentLink2URL: https://www.digikey.com/en/products/detail/koa-speer-electronics-inc/RK73H2ATTD2492F/10234069; ComponentLink3Description: Mouser; ComponentLink3URL: https://eu.mouser.com/ProductDetail/KOA-Speer/RK73H2ATTD2492F?qs=V1Gdg3MQOGsrJO3v1jKV%252Bg%3D%3D
R18 = Res 3kΩ 0603(1608) 0.5% 0.1W RT0603DRE073KL: Res Thin Film 0603 3kΩ 0.5% 0.1W(1/10W) ±50ppm/C Pad SMD T/R; Manufacturer: Yageo; Voltage Rating: 75V; Power Rating: 100mW; Temperature Coefficient: 50ppm/°C; Voltage Rating (DC): 50V; Supplier 1: Digi-Key; Manufacturer Part Number: RT0603DRE073KL; RoHS: Yes; Category: Chip SMD Resistors; Stock 1: 9385; Pricing 1: 1=0.11, 10=0.096, 100=0.037, 500=0.02292, 1000=0.01626, 2500=0.01404 (USD); Case/Package: 0603; Case Code (Metric): 1608; Case Code (Imperial): 0603; Min Operating Temperature: -55°C; Max Operating Temperature: 155°C; Tolerance: 0.5%; Packaging: Tape and Reel; Number of Terminations: 2; Termination: SMD/SMT; Max Power Dissipation: 100mW; Features: Moisture Resistant; Series: RT; Length: 0.063inch; Width: 0.031inch; Height: 0.022inch; Lead Free: Lead Free; RoHS Compliant: Yes; Supplier 2: Mouser; Stock 2: 6302; Pricing 2: 1=0.11, 10=0.096, 50=0.096, 100=0.023, 1000=0.014, 10000=0.012 (USD); Supplier Part Number 1: 311-2574-1-ND; Supplier Part Number 2: 603-RT0603DRE073KL; ComponentLink1Description: DataSheet; ComponentLink1URL: https://www.yageo.com/upload/media/product/productsearch/datasheet/rchip/PYu-RT_1-to-0.01_RoHS_L_15.pdf; ComponentLink2Description: Digikey; ComponentLink2URL: https://www.digikey.com/en/products/detail/yageo/RT0603DRE073KL/1074848
R19 = Res 1kΩ 0603(1608) 0.1% 0.1W_RN73R1JTTD1001B25: Res Thin Film 0603 1kΩ 0.1% 0.1W(1/10W) ±25ppm/C Sulfur Resistant Pad SMD Automotive T/R; Manufacturer: KOA Speer; Max Power Dissipation: 100mW; Temperature Coefficient: 25ppm/°C; Supplier 1: Digi-Key; Manufacturer Part Number: RN73R1JTTD1001B25; RoHS: Yes; Category: Chip SMD Resistors; Stock 1: 20286; Pricing 1: 1=0.2, 10=0.146, 50=0.1144, 100=0.102, 500=0.07706, 1000=0.06788 (USD); Case/Package: 0603; Case Code (Imperial): 0603; Case Code (Metric): 1608; Min Operating Temperature: -55°C; Max Operating Temperature: 155°C; Features: Moisture Resistant; Series: RN73R; Packaging: Cut Tape; Tolerance: 0.1%; Number of Terminations: 2; RoHS Compliant: Yes; Supplier 2: Mouser; Stock 2: 31590; Pricing 2: 1=0.2, 10=0.115, 50=0.115, 100=0.102, 1000=0.068, 10000=0.05 (USD); Supplier Part Number 1: 2019-RN73R1JTTD1001B25CT-ND; Supplier Part Number 2: 660-RN73R1JTD1001B25; ComponentLink1Description: DataSheet; ComponentLink1URL: https://www.koaspeer.com/pdfs/RN73R.pdf; ComponentLink2Description: Digikey; ComponentLink2URL: https://www.digikey.com/en/products/detail/koa-speer-electronics-inc/RN73R1JTTD1001B25/9991865; ComponentLink3Description: Mouser; ComponentLink3URL: https://eu.mouser.com/ProductDetail/KOA-Speer/RN73R1JTTD1001B25?qs=2WXlatMagcG9rUOLC1KorA%3D%3D
RSR = Res 0.01Ω 2512(6432) 1% 3W_CRA2512-FZ-R010ELF: SMD Current Sense Resistor, 0.01Ω 1%, 3 W, 2512 [6432 Metric], Metal Alloy; Manufacturer: Bourns; Supplier 1: Digikey; Manufacturer Part Number: CRA2512-FZ-R010ELF; RoHS: No; Category: Chip SMD Resistors; Stock 1: 49784; Pricing 1: 1=0.64, 10=0.427, 25=0.3544, 50=0.3, 100=0.2245, 250=0.2, 500=0.16362, 1000=0.12726 (USD); Case/Package: 348Case; Pins: 2NUMBER; Min Operating Temperature: -55°C; Max Operating Temperature: 170°C; Packaging: 13Packaging; Tolerance: 1%; Width: 3.2mm; Height: 900um; Supplier 2: Mouser; Stock 2: 36722; Pricing 2: 1=0.64, 10=0.292, 50=0.292, 100=0.2, 1000=0.128, 10000=0.116 (USD); Supplier Part Number 1: CRA2512-FZ-R010ELFCT-ND; Supplier Part Number 2: 652-CRA2512FZR010ELF; ComponentLink1Description: DataSheet; ComponentLink1URL: https://www.bourns.com/docs/product-datasheets/cra.pdf; ComponentLink2Description: Digikey; ComponentLink2URL: https://www.digikey.com/en/products/detail/bourns-inc/CRA2512-FZ-R010ELF/1775029?s=N4IgTCBcDaIMICUCCYCsBGMBaAYgLSwQAZ0iBRAGRzgBUsA5AERAF0BfIA; ComponentLink3Description: Mouser; ComponentLink3URL: https://eu.mouser.com/ProductDetail/Bourns/CRA2512-FZ-R010ELF?qs=WqWCsLCZBkoNPiv%2FXVnYvw%3D%3D
TP6 TP7 TP11 TP12 = Misc. TP SMD 1mm DIA
U2 = IC Misc. Batt Charge_BQ24650RVAR: Charger IC Multi-Chemistry 16-VQFN (3.5x3.5); Manufacturer: Texas Instruments; Supplier 1: Digi-Key; Manufacturer Part Number: BQ24650RVAR; RoHS: Yes; Category: Battery Management; Stock 1: 6655; Pricing 1: 1=4.95, 10=4.442, 25=4.1996, 100=3.6396, 250=3.453, 500=3.09836, 1000=2.61307 (USD); Supplier 2: Mouser; Stock 2: 7875; Pricing 2: 1=4.94, 10=4.44, 50=4.44, 100=3.63, 1000=2.61, 10000=2.48 (USD); Supplier Part Number 1: 296-46287-1-ND; Supplier Part Number 2: 595-BQ24650RVAR; ComponentLink1Description: DataSheet; ComponentLink1URL: https://www.ti.com/general/docs/suppproductinfo.tsp?distId=10&gotoUrl=https%3A%2F%2Fwww.ti.com%2Flit%2Fgpn%2Fbq24650; ComponentLink2Description: Digikey; ComponentLink2URL: https://www.digikey.com/en/products/detail/texas-instruments/BQ24650RVAR/2596772?s=N4IgTCBcDaIEIEUwBYBsBWADAJQGoEFsQBdAXyA; ComponentLink3Description: Mouser; ComponentLink3URL: https://eu.mouser.com/ProductDetail/Texas-Instruments/BQ24650RVAR?qs=0zjllh%252Bnl7YoFsOK3aOUFA%3D%3D
U3 = IC PMU Buck 5V 3A TO-263_LM2596DSADJG: Conv DC-DC 4.5V to 40V Step Down Single-Out 1.23V to 37V 3A 6-Pin(5+Tab) D2PAK Tube; Manufacturer: ON Semiconductor; Topology: 6153TopologyType; Max Duty Cycle: 95%; Nominal Supply Current: 5mA; Supplier: Digikey; Supplier Part Number: LM2596DSADJGOS-ND; Manufacturer Part Number: LM2596DSADJG; RoHS: Yes; Category: Voltage Regulators - Switching; Stock: 1605; Pricing: 1=3.53, 10=2.258, 50=1.7206, 100=1.5491, 250=1.36444, 500=1.25086, 1000=1.15572, 2500=1.09488 (USD); Max Supply Voltage: 40V; Min Supply Voltage: 4.5V; Lead Free: 5697LeadFree; Halogen Free: 5694HalogenFree; ComponentLink1Description: DataSheet; ComponentLink1URL: https://www.onsemi.com/pdf/datasheet/lm2596-d.pdf; ComponentLink2Description: Digikey; ComponentLink2URL: https://www.digikey.com/en/products/detail/onsemi/LM2596DSADJG/2003290; ComponentLink3Description: Mouser; ComponentLink3URL: https://eu.mouser.com/ProductDetail/onsemi/LM2596DSADJG?qs=atIEnC%2F2K4W1Dy%252BFjrRjIQ%3D%3D